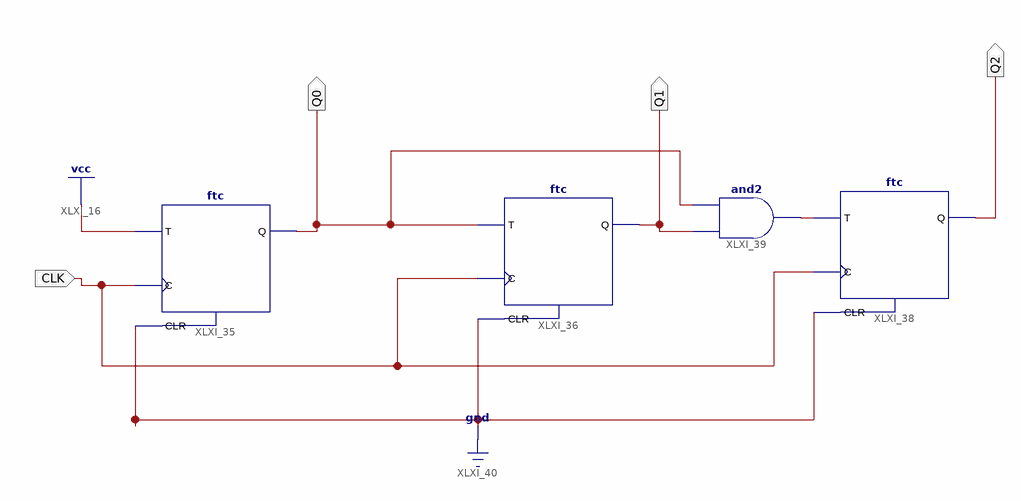
[diagram p0: schematic sheet 1]
// Xilinx ISE schematic Q2.sch (spartan6) as structural Verilog: 4 symbols, 4 ports
module Q2 (
  input  CLK,
  output Q0,
  output Q1,
  output Q2
);

  wire XLXN_117;

  ftc XLXI_35 (.C(CLK), .CLR(1'b0), .T(1'b1), .Q(Q0));
  ftc XLXI_36 (.C(CLK), .CLR(1'b0), .T(Q0), .Q(Q1));
  ftc XLXI_38 (.C(CLK), .CLR(1'b0), .T(XLXN_117), .Q(Q2));
  and XLXI_39 (XLXN_117, Q1, Q0);
endmodule
